# EAGLE design hbridge (EAGLE 7.4.0)
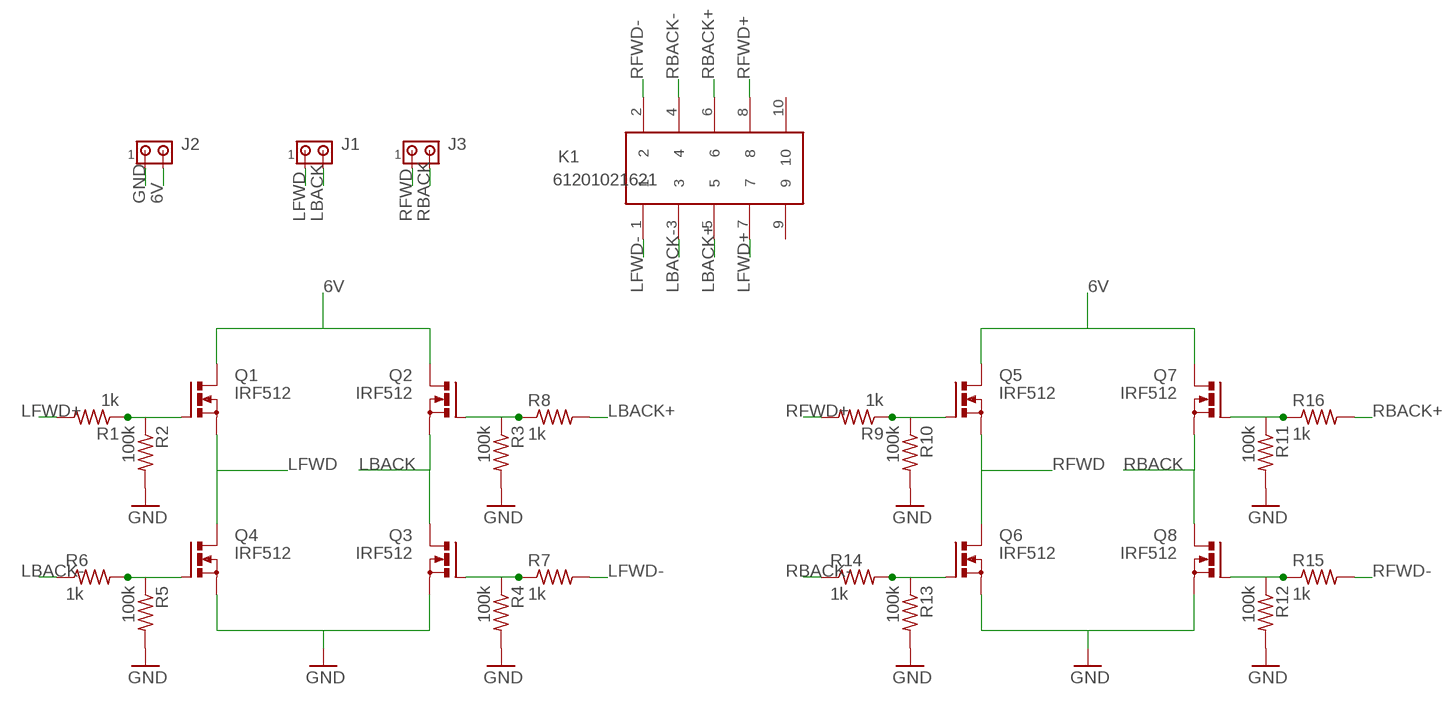
[diagram p0: schematic, sheet 1]

## Parts
J1  MTA02-100  [10X02MTA]
J2  MTA02-100  [10X02MTA]
J3  MTA02-100  [10X02MTA]
K1  61201021621  [61201021621]
Q1  IRF512  [TO220BV]
Q2  IRF512  [TO220BV]
Q3  IRF512  [TO220BV]
Q4  IRF512  [TO220BV]
Q5  IRF512  [TO220BV]
Q6  IRF512  [TO220BV]
Q7  IRF512  [TO220BV]
Q8  IRF512  [TO220BV]
R1  1k  R-US_0204/7  [0204/7]
R2  100k  R-US_0204/7  [0204/7]
R3  100k  R-US_0204/7  [0204/7]
R4  100k  R-US_0204/7  [0204/7]
R5  100k  R-US_0204/7  [0204/7]
R6  1k  R-US_0204/7  [0204/7]
R7  1k  R-US_0204/7  [0204/7]
R8  1k  R-US_0204/7  [0204/7]
R9  1k  R-US_0204/7  [0204/7]
R10  100k  R-US_0204/7  [0204/7]
R11  100k  R-US_0204/7  [0204/7]
R12  100k  R-US_0204/7  [0204/7]
R13  100k  R-US_0204/7  [0204/7]
R14  1k  R-US_0204/7  [0204/7]
R15  1k  R-US_0204/7  [0204/7]
R16  1k  R-US_0204/7  [0204/7]

## Nets
6V: J2.2 Q1.D Q2.D Q5.D Q7.D
GND: J2.1 Q3.S Q4.S Q6.S Q8.S R2.2 R3.2 R4.2 R5.2 R10.2 R11.2 R12.2 R13.2
LBACK: J1.2 Q2.S Q3.D
LBACK+: K1.5 R8.2
LBACK-: K1.3 R6.1
LFWD: J1.1 Q1.S Q4.D
LFWD+: K1.7 R1.2
LFWD-: K1.1 R7.2
N$1: Q3.G R4.1 R7.1
N$2: Q2.G R3.1 R8.1
N$3: Q4.G R5.1 R6.2
N$4: Q1.G R1.1 R2.1
N$5: Q8.G R12.1 R15.1
N$6: Q7.G R11.1 R16.1
N$7: Q6.G R13.1 R14.2
N$8: Q5.G R9.1 R10.1
RBACK: J3.2 Q7.S Q8.D
RBACK+: K1.6 R16.2
RBACK-: K1.4 R14.1
RFWD: J3.1 Q5.S Q6.D
RFWD+: K1.8 R9.2
RFWD-: K1.2 R15.2
Unconnected: K1.9 K1.10

## Library data of the parts
J1-J3 = con-amp:MTA02-100: AMP connector
K1 = Wurth_Elektronik_Electromechanic_Wire_to_Board_Connectors_rev15c:61201021621: WR-BHD 2.54mm Male Box Header, 10 Pins=>Code : Con_WTB_BHD_2.54_Male_THT_WS_61201021621 <http://katalog.we-online.de/media/thumbs2/eican/thb_Con_WTB_BHD_2.54_Male_THT_WS_6120xx21621_pf2.jpg> Details see: http://katalog.we-online.de/en/em/612_0xx_216_21 Created 2014-06-04, Karrer Zheng 2014 (C) Würth Elektronik
Q1-Q8 = transistor-power:IRF512: N-CHANNEL MOS FET
R1-R16 = rcl:R-US_: RESISTOR, American symbol

## Board
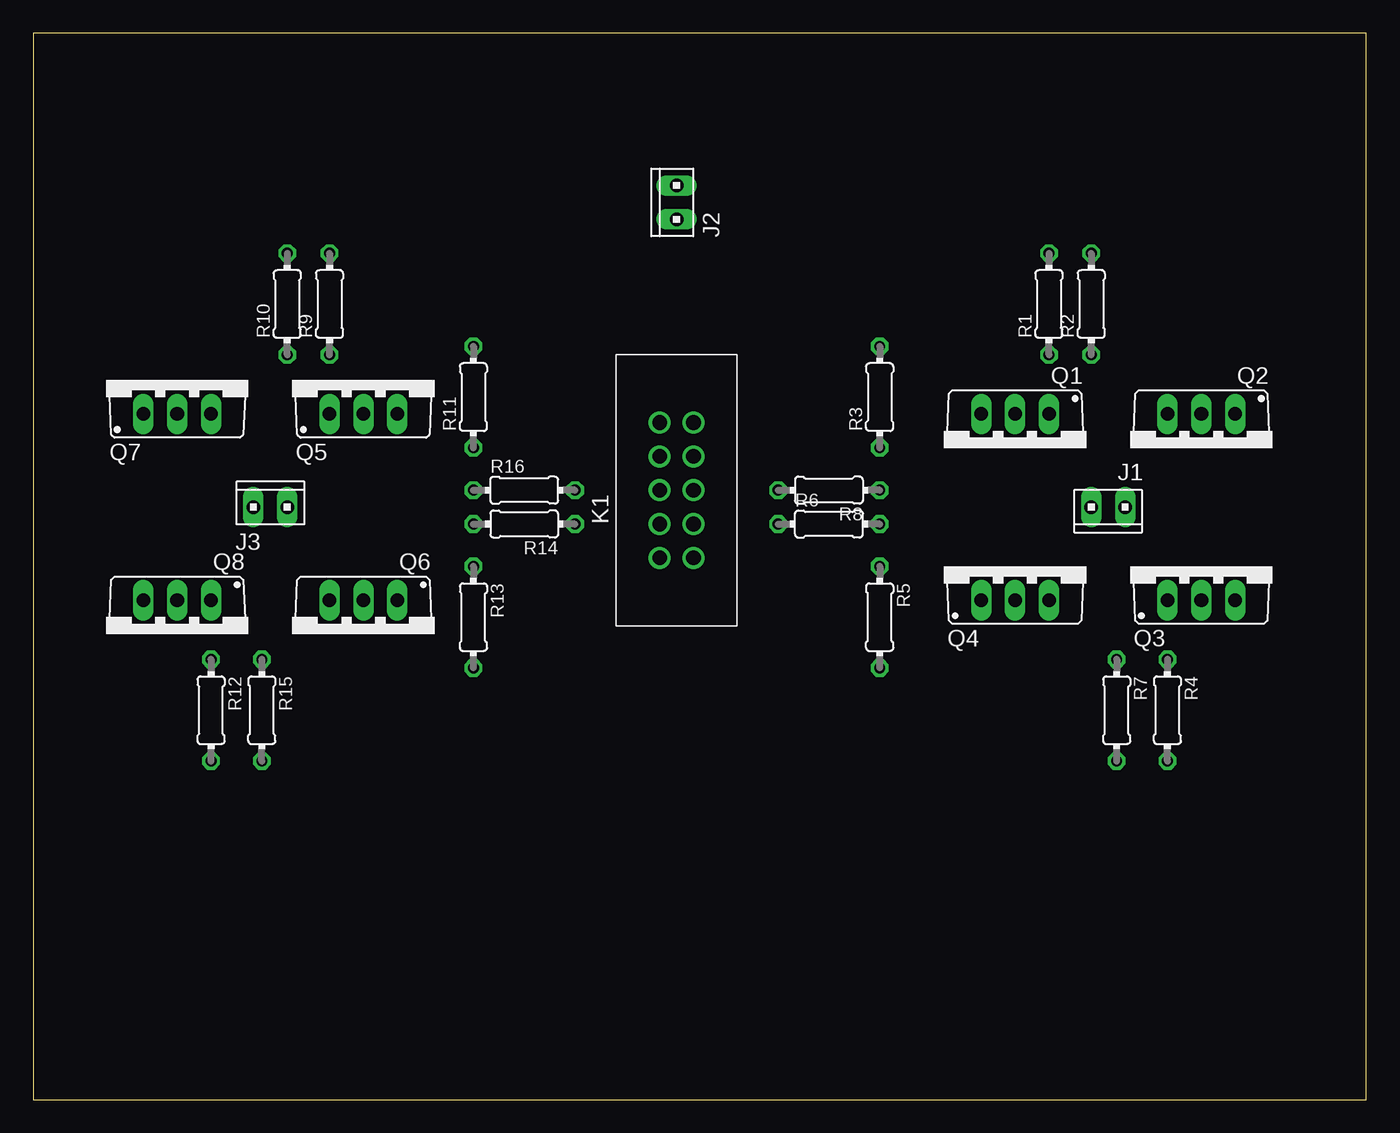
[diagram p1: board, top side]
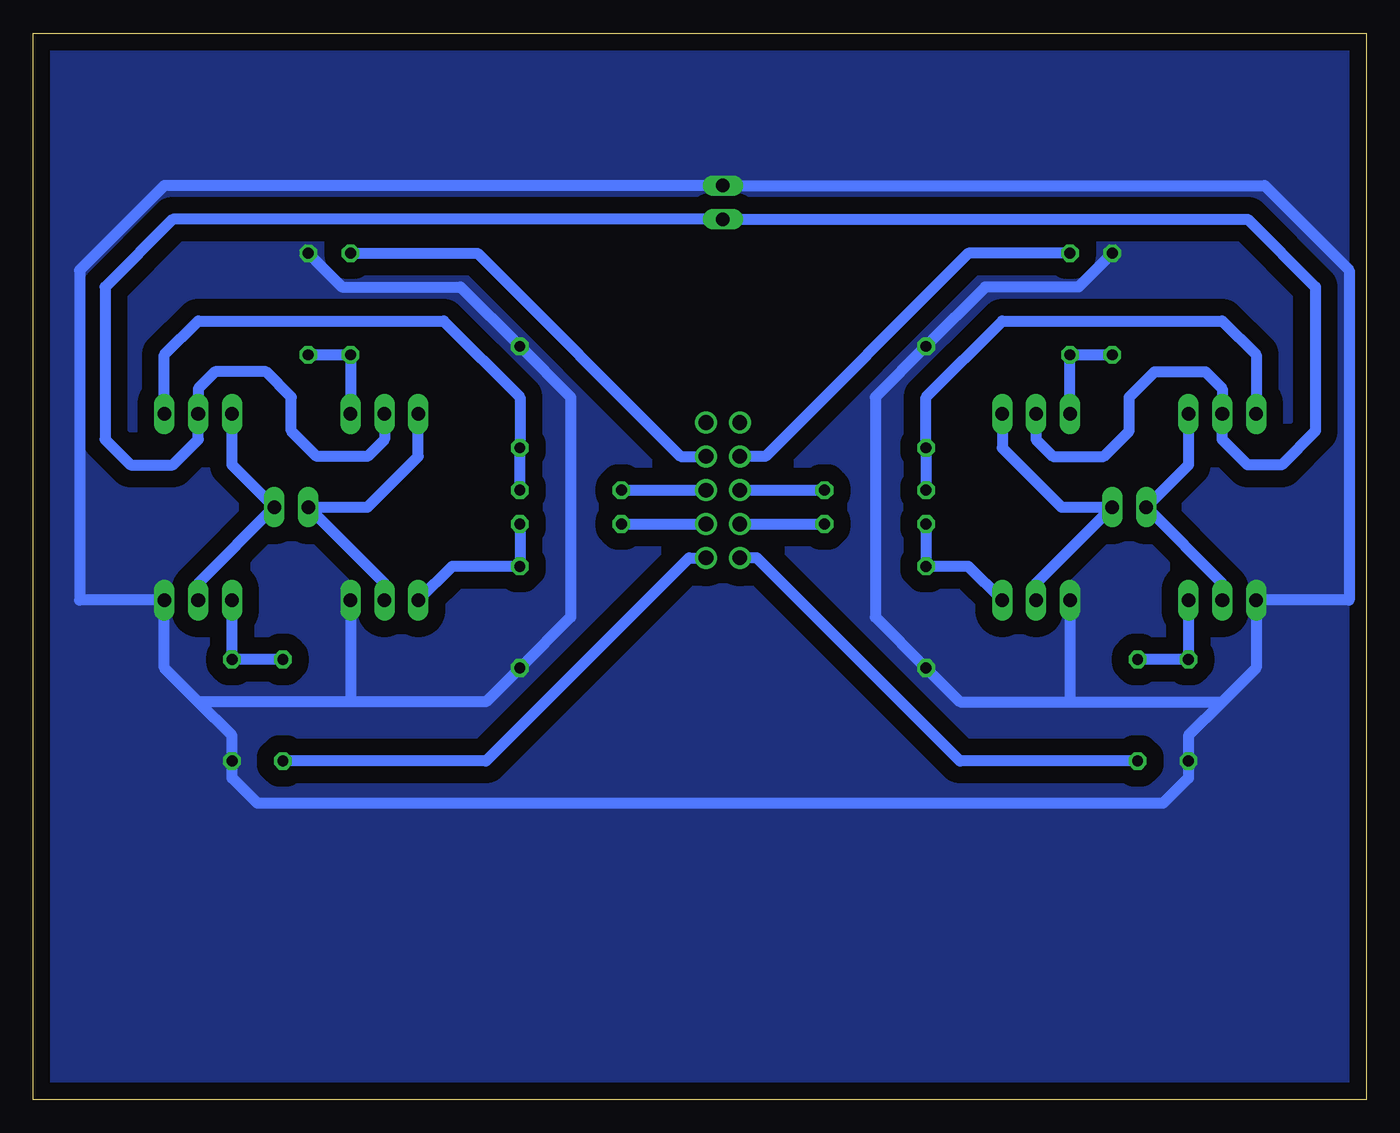
[diagram p2: board, bottom side, seen from below]

Size 100 x 80 mm. Coordinates in mm from the lower left corner, seen from the top.
Outline: 0,0 100,0 100,80 0,80 0,0
Copper layers (1*16): Top 0.035mm / dielectric 1.5mm / Bottom 0.035mm
Design rules "default": minimum track width 10mil, minimum drill 24mil, track to track 8mil, track to pad 8mil, pad to pad 8mil, via to via 8mil, smd to smd 8mil, copper to edge 40mil, drill to drill 8mil, minimum pad ring 10mil, minimum via ring 8mil, stop-mask expansion 4mil, vias tented up to drill 0mil, thermal gap 10mil

### Footprints (pad centres in the part's own frame; a part is rotated, then mirrored left to right if it is on the bottom)
10X02MTA = drill 1.016 long: 1 1.27,0; 2 -1.27,0
61201021621 = drill 1.1: 1 -2.54,-1.27; 2 -2.54,1.27; 3 0,-1.27; 4 0,1.27; 5 2.54,-1.27; 6 2.54,1.27; 7 5.08,-1.27; 8 5.08,1.27; 9 7.62,-1.27; 10 7.62,1.27
TO220BV = drill 1.016 long: D 0,-2.54; G -2.54,-2.54; S 2.54,-2.54
0204/7 = drill 0.813 octagon: 1 -3.81,0; 2 3.81,0

### Placement (x,y rotation side)
J1  80.64,44.45 180 top
J2  48.26,67.31 90 top
J3  17.78,44.45 0 top
K1  48.26,43.18 90 top
Q1  73.66,48.9 180 top
Q2  87.63,48.9 180 top
Q3  87.63,40.01 0 top
Q4  73.66,40.01 0 top
Q5  24.77,53.98 0 top
Q6  24.77,34.92 180 top
Q7  10.79,53.98 0 top
Q8  10.79,34.92 180 top
R1  76.2,59.69 90 top
R2  79.38,59.69 90 top
R3  63.5,52.7 90 top
R4  85.09,29.21 270 top
R5  63.5,36.2 270 top
R6  59.69,43.18 0 top
R7  81.28,29.21 270 top
R8  59.69,45.72 180 top
R9  22.23,59.69 90 top
R10  19.05,59.69 90 top
R11  33.02,52.7 90 top
R12  13.34,29.21 270 top
R13  33.02,36.2 270 top
R14  36.83,43.18 180 top
R15  17.14,29.21 270 top
R16  36.83,45.72 0 top

### Tracks (layer width: path | path; a pad name or v marks a point on that pad's centre or on a via)
6V
  Bottom 0.813: Q1.D 73.66,49.53 74.93,48.26 78.74,48.26 80.64,50.16 80.64,52.7 82.55,54.61 86.36,54.61 87.63,53.34 Q2.D 87.63,49.53 89.53,47.62 92.71,47.62 94.61,49.53 94.61,60.96 89.53,66.04 J2.2 8.89,66.04 3.81,60.96 3.81,50.16 6.35,47.62 8.89,47.62 10.79,49.53 Q7.D 10.79,53.34 12.06,54.61 15.88,54.61 17.78,52.7 17.78,50.16 19.68,48.26 23.5,48.26 24.77,49.53 Q5.D
GND
  Bottom 0.813: R2.2 76.83,60.96 67.94,60.96 R3.2 59.69,52.7 59.69,36.2 R5.2 66.04,29.84 76.2,29.84 | 76.2,29.84 87.63,29.84 | 87.63,29.84 90.17,32.38 Q3.S 96.52,37.47 96.52,62.23 90.17,68.58 J2.1 7.62,68.58 1.27,62.23 1.27,37.47 Q8.S 8.26,32.38 10.79,29.84 | Q4.S 76.2,29.84 | 87.63,29.84 85.09,27.3 R4.2 85.09,24.13 83.19,22.23 15.24,22.23 13.34,24.13 R12.2 13.34,27.3 10.79,29.84 | 22.23,29.84 30.48,29.84 R13.2 36.83,36.2 36.83,52.7 R11.2 28.57,60.96 21.59,60.96 R10.2 | 22.23,29.84 10.79,29.84 | Q6.S 22.23,29.84
  pour Bottom (isolate 1.27, no thermals): 0.64,79.38 0.64,0.64 99.69,0.64 99.69,79.38
LBACK
  Bottom 0.813: Q3.D 87.63,38.73 J1.2 85.09,47.62 Q2.S
LBACK+
  Bottom 0.813: R8.2 K1.5
LBACK-
  Bottom 0.813: R6.1 K1.3
LFWD
  Bottom 0.813: Q4.D 73.66,38.73 J1.1 74.93,44.45 71.12,48.26 Q1.S
LFWD+
  Bottom 0.813: R1.2 66.67,63.5 51.44,48.26 K1.7
LFWD-
  Bottom 0.813: R7.2 66.04,25.4 50.8,40.64 K1.1
N$1
  Bottom 0.813: Q3.G R4.1 R7.1
N$2
  Bottom 0.813: R8.1 R3.1 63.5,52.7 69.22,58.42 87.63,58.42 90.17,55.88 Q2.G
N$3
  Bottom 0.813: R6.2 R5.1 68.58,40.01 Q4.G
N$4
  Bottom 0.813: Q1.G R1.1 R2.1
N$5
  Bottom 0.813: Q8.G R12.1 R15.1
N$6
  Bottom 0.813: R16.1 R11.1 33.02,52.7 27.3,58.42 10.79,58.42 8.26,55.88 Q7.G
N$7
  Bottom 0.813: R14.2 R13.1 29.84,40.01 Q6.G
N$8
  Bottom 0.813: Q5.G R9.1 R10.1
RBACK
  Bottom 0.813: Q7.S 13.34,47.62 J3.2 10.79,38.73 Q8.D
RBACK+
  Bottom 0.813: K1.6 R16.2
RBACK-
  Bottom 0.813: K1.4 R14.1
RFWD
  Bottom 0.813: Q6.D 24.77,38.73 J3.1 22.86,44.45 27.3,48.9 Q5.S
RFWD+
  Bottom 0.813: R9.2 29.84,63.5 45.09,48.26 K1.8
RFWD-
  Bottom 0.813: R15.2 30.48,25.4 45.72,40.64 K1.2